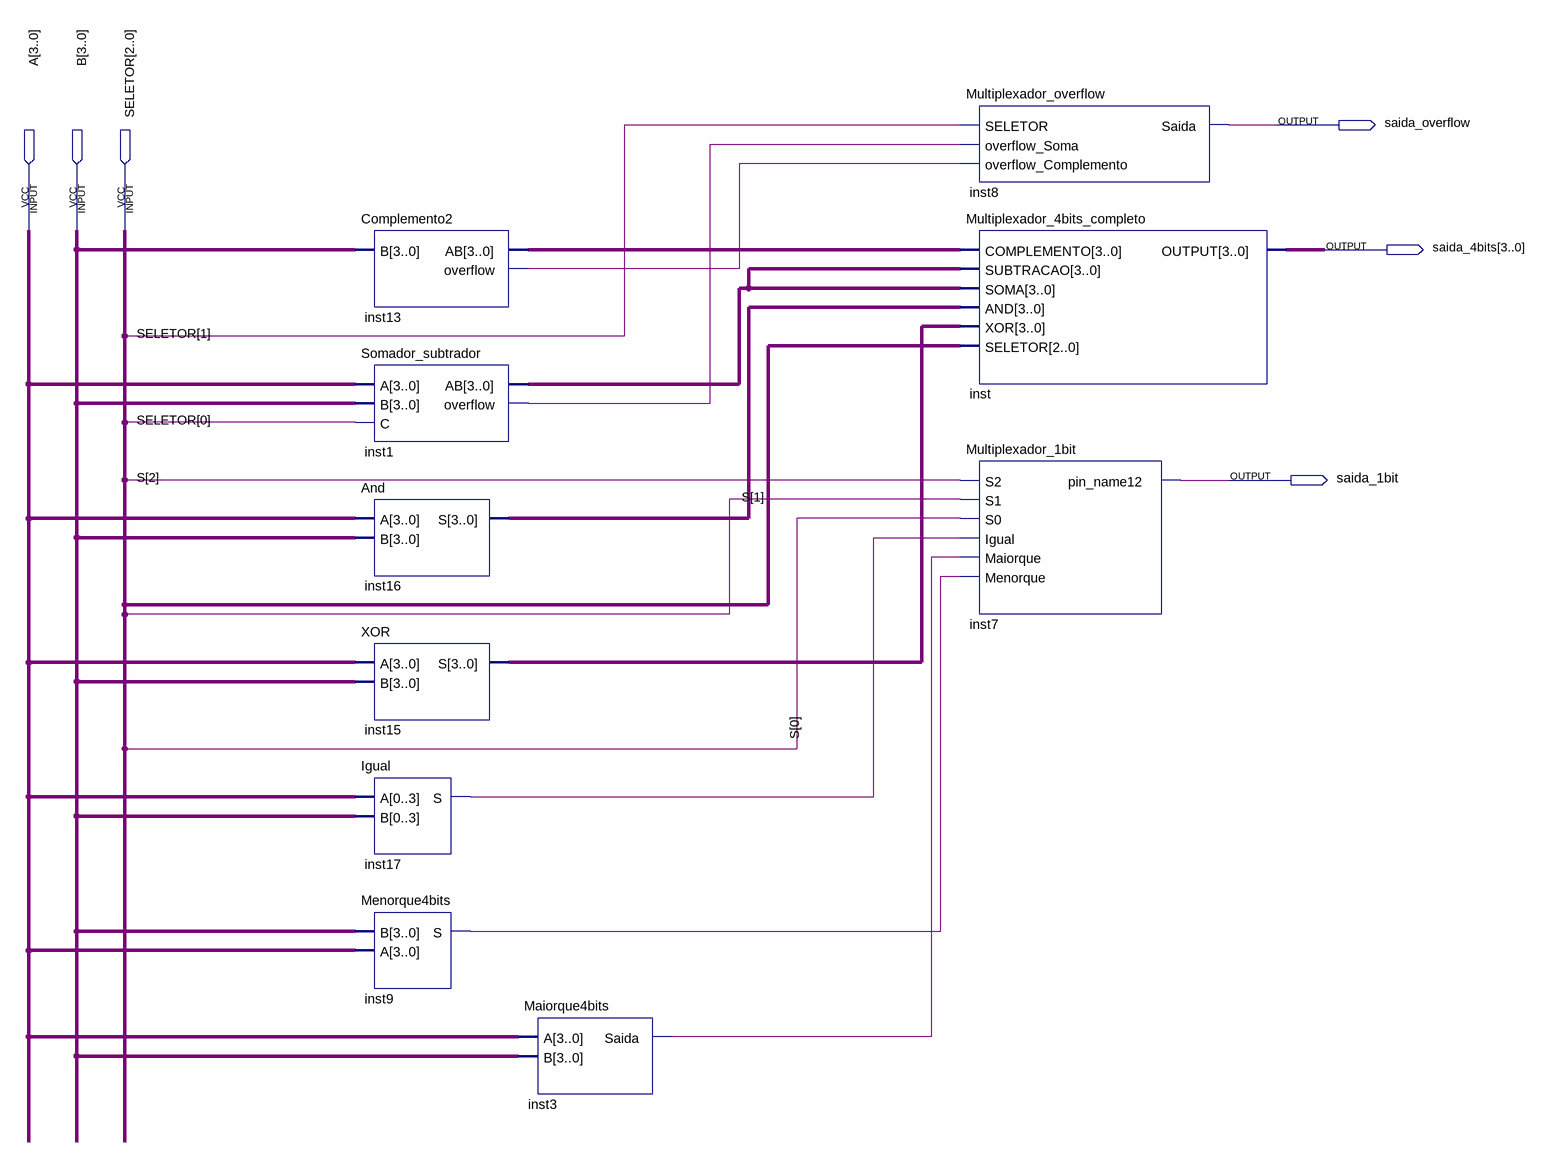
[diagram p0: schematic sheet]
// Quartus schematic ULA.bdf as structural Verilog: 10 symbols, 6 pins
module ULA (
  input  [3:0] A,
  input  [3:0] B,
  input  [2:0] SELETOR,
  output saida_overflow,
  output [3:0] saida_4bits,
  output saida_1bit
);

  wire inst1_overflow, inst3_saida, inst9_s, inst13_overflow, inst17_s;
  wire [2:0] S;
  wire [3:0] inst1_ab, inst13_ab, inst15_s, inst16_s;

  Complemento2 inst13 (.B(B), .AB(inst13_ab), .overflow(inst13_overflow));
  Somador_subtrador inst1 (.A(A), .B(B), .C(SELETOR[0]), .AB(inst1_ab), .overflow(inst1_overflow));
  And inst16 (.A(A), .B(B), .S(inst16_s));
  XOR inst15 (.A(A), .B(B), .S(inst15_s));
  Igual inst17 (.A(A), .B(B), .S(inst17_s));
  Menorque4bits inst9 (.B(B), .A(A), .S(inst9_s));
  Maiorque4bits inst3 (.A(A), .B(B), .Saida(inst3_saida));
  Multiplexador_overflow inst8 (
    .SELETOR(SELETOR[1]), .overflow_Soma(inst1_overflow), .overflow_Complemento(inst13_overflow),
    .Saida(saida_overflow));
  Multiplexador_4bits_completo inst (
    .COMPLEMENTO(inst13_ab), .SUBTRACAO(inst1_ab), .SOMA(inst1_ab), .AND(inst16_s), .XOR(inst15_s),
    .SELETOR(SELETOR), .OUTPUT(saida_4bits));
  Multiplexador_1bit inst7 (
    .S2(S[2]), .S1(S[1]), .S0(S[0]), .Igual(inst17_s), .Maiorque(inst3_saida), .Menorque(inst9_s),
    .pin_name12(saida_1bit));
endmodule
